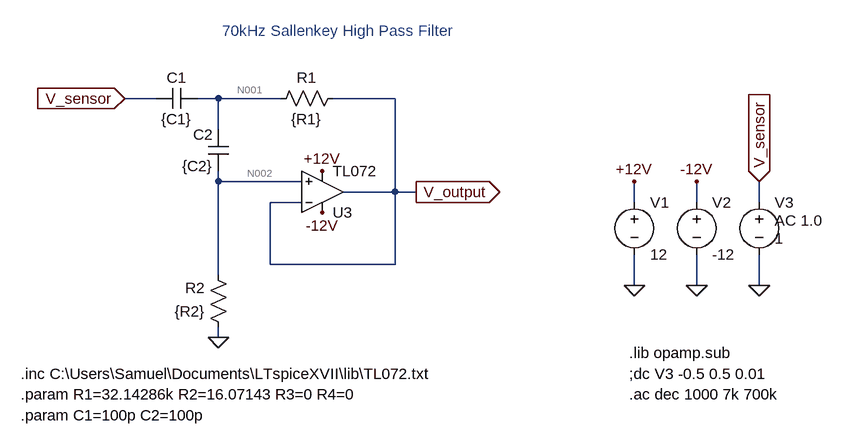
[diagram p0: schematic SallenKeyHighPassFIlter.asc]
SallenKeyHighPassFIlter.asc, the LTspice schematic file:
Version 4
SHEET 1 2508 680
WIRE -864 -512 -912 -512
WIRE -768 -512 -800 -512
WIRE -672 -512 -768 -512
WIRE -496 -512 -592 -512
WIRE -768 -464 -768 -512
WIRE -768 -384 -768 -400
WIRE -640 -384 -768 -384
WIRE -496 -368 -496 -512
WIRE -496 -368 -576 -368
WIRE -464 -368 -496 -368
WIRE -640 -352 -688 -352
WIRE -128 -352 -128 -384
WIRE -32 -352 -32 -384
WIRE 64 -352 64 -384
WIRE -688 -256 -688 -352
WIRE -496 -256 -496 -368
WIRE -496 -256 -688 -256
WIRE -768 -240 -768 -384
WIRE -128 -224 -128 -272
WIRE -32 -224 -32 -272
WIRE 64 -224 64 -272
WIRE -768 -144 -768 -160
FLAG -32 -224 0
FLAG -128 -224 0
FLAG -128 -384 +12V
FLAG -32 -384 -12V
FLAG -464 -368 V_output
IOPIN -464 -368 Out
FLAG -608 -400 +12V
FLAG -608 -336 -12V
FLAG -912 -512 V_sensor
IOPIN -912 -512 In
FLAG 64 -224 0
FLAG 64 -384 V_sensor
IOPIN 64 -384 In
FLAG -768 -144 0
SYMBOL voltage -128 -368 R0
WINDOW 123 0 0 Left 2
WINDOW 39 0 0 Left 2
SYMATTR InstName V1
SYMATTR Value 12
SYMBOL voltage -32 -368 R0
WINDOW 123 0 0 Left 2
WINDOW 39 0 0 Left 2
SYMATTR InstName V2
SYMATTR Value -12
SYMBOL Opamps\\opamp2 -608 -304 M180
SYMATTR InstName U3
SYMATTR Value TL072
SYMBOL cap -800 -528 R90
WINDOW 0 0 32 VBottom 2
WINDOW 3 32 32 VTop 2
SYMATTR InstName C1
SYMATTR Value {C1}
SYMBOL cap -752 -400 R180
WINDOW 0 24 56 Left 2
WINDOW 3 24 8 Left 2
SYMATTR InstName C2
SYMATTR Value {C2}
SYMBOL voltage 64 -368 R0
WINDOW 123 24 44 Left 2
WINDOW 39 0 0 Left 2
WINDOW 3 24 72 Left 2
SYMATTR Value2 AC 1.0
SYMATTR Value 1
SYMATTR InstName V3
SYMBOL res -576 -528 R90
WINDOW 0 0 56 VBottom 2
WINDOW 3 32 56 VTop 2
SYMATTR InstName R1
SYMATTR Value {R1}
SYMBOL res -752 -144 R180
WINDOW 0 36 76 Left 2
WINDOW 3 36 40 Left 2
SYMATTR InstName R2
SYMATTR Value {R2}
TEXT -136 -120 Left 2 !.lib opamp.sub
TEXT -584 -616 Center 2 ;70kHz Sallenkey High Pass Filter
TEXT -136 -88 Left 2 !;dc V3 -0.5 0.5 0.01
TEXT -136 -56 Left 2 !.ac dec 1000 7k 700k
TEXT -1072 -88 Left 2 !.inc C:\\Users\\Samuel\\Documents\\LTspiceXVII\\lib\\TL072.txt
TEXT -1072 -56 Left 2 !.param R1=32.14286k R2=16.07143 R3=0 R4=0
TEXT -1072 -24 Left 2 !.param C1=100p C2=100p

The netlist it stands for:
* SallenKeyHighPassFIlter.asc
V1 +12V 0 12
V2 -12V 0 -12
XU3 N002 V_output -12V +12V V_output TL072  ; pins In+ In- V+ V- OUT
C1 N001 V_sensor {C1}
C2 N002 N001 {C2}
V3 V_sensor 0 1 AC 1.0
R1 V_output N001 {R1}
R2 0 N002 {R2}
.lib opamp.sub
* 70kHz Sallenkey High Pass Filter
;dc V3 -0.5 0.5 0.01
.ac dec 1000 7k 700k
.inc C:\Users\Samuel\Documents\LTspiceXVII\lib\TL072.txt
.param R1=32.14286k R2=16.07143 R3=0 R4=0
.param C1=100p C2=100p
.backanno
.end

* Results of the author's LTspice run, read from the files saved beside the schematic
* Operating Point, zero values left out:
*   V(+12v) = 12 V
*   V(-12v) = -12 V
*   V(n002) = 51.29 mV
*   V(v_sensor) = 1 V
*   I(R2) = -3.191 mA
*   I(V2) = 35.21 TA
*   I(V1) = -35.21 TA
*   Ix(u3:1) = -3.191 mA
*   Ix(u3:2) = -3.496 mA
*   Ix(u3:3) = -35.21 TA
*   Ix(u3:4) = 35.21 TA
*   Ix(u3:5) = 5.859 mA
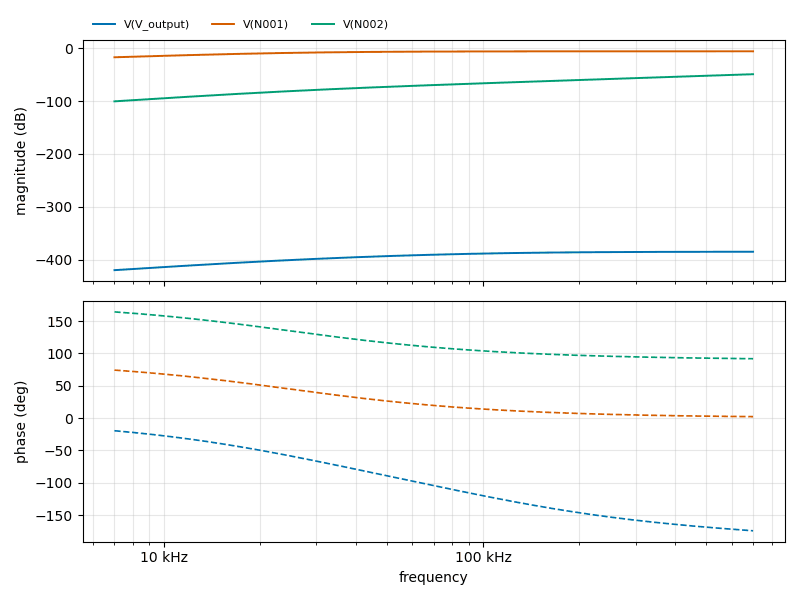
[diagram p1: AC Analysis of SallenKeyHighPassFIlter.asc, plotted from the saved traces]
* AC Analysis, 1 run:
*   V(V_output): -419.76 dB at 7 kHz, -384.90 dB at 700 kHz, peak -384.90 dB at 700 kHz, 3 dB below the peak at 109.6 kHz
*   V(N001): -17.33 dB at 7 kHz, -6.03 dB at 700 kHz, peak -6.03 dB at 700 kHz, 3 dB below the peak at 24.72 kHz
*   V(N002): -100.64 dB at 7 kHz, -49.34 dB at 700 kHz, peak -49.34 dB at 700 kHz, 3 dB below the peak at 495.3 kHz